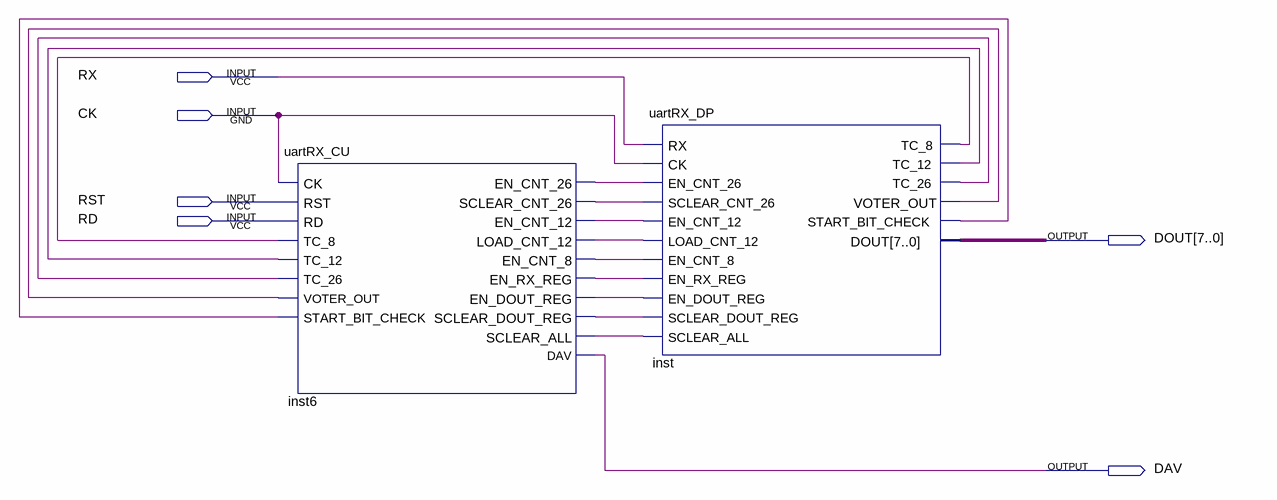
[diagram p0: schematic sheet]
// Quartus schematic uartRX.bdf as structural Verilog: 2 symbols, 6 pins
module uartRX (
  input  RX,
  input  CK,
  input  RST,
  input  RD,
  output [7:0] DOUT,
  output DAV
);

  wire inst6_en_cnt_8, inst6_en_cnt_12, inst6_en_cnt_26, inst6_en_dout_reg, inst6_en_rx_reg,
       inst6_load_cnt_12, inst6_sclear_all, inst6_sclear_cnt_26, inst6_sclear_dout_reg, inst_start_bit_check,
       inst_tc_8, inst_tc_12, inst_tc_26, inst_voter_out;

  uartRX_CU inst6 (
    .CK(CK), .RST(RST), .RD(RD), .TC_8(inst_tc_8), .TC_12(inst_tc_12), .TC_26(inst_tc_26),
    .VOTER_OUT(inst_voter_out), .START_BIT_CHECK(inst_start_bit_check), .EN_CNT_26(inst6_en_cnt_26),
    .SCLEAR_CNT_26(inst6_sclear_cnt_26), .EN_CNT_12(inst6_en_cnt_12), .LOAD_CNT_12(inst6_load_cnt_12),
    .EN_CNT_8(inst6_en_cnt_8), .EN_RX_REG(inst6_en_rx_reg), .EN_DOUT_REG(inst6_en_dout_reg),
    .SCLEAR_DOUT_REG(inst6_sclear_dout_reg), .SCLEAR_ALL(inst6_sclear_all), .DAV(DAV));
  uartRX_DP inst (
    .RX(RX), .CK(CK), .EN_CNT_26(inst6_en_cnt_26), .SCLEAR_CNT_26(inst6_sclear_cnt_26),
    .EN_CNT_12(inst6_en_cnt_12), .LOAD_CNT_12(inst6_load_cnt_12), .EN_CNT_8(inst6_en_cnt_8),
    .EN_RX_REG(inst6_en_rx_reg), .EN_DOUT_REG(inst6_en_dout_reg), .SCLEAR_DOUT_REG(inst6_sclear_dout_reg),
    .SCLEAR_ALL(inst6_sclear_all), .TC_8(inst_tc_8), .TC_12(inst_tc_12), .TC_26(inst_tc_26),
    .VOTER_OUT(inst_voter_out), .START_BIT_CHECK(inst_start_bit_check), .DOUT(DOUT));
endmodule
